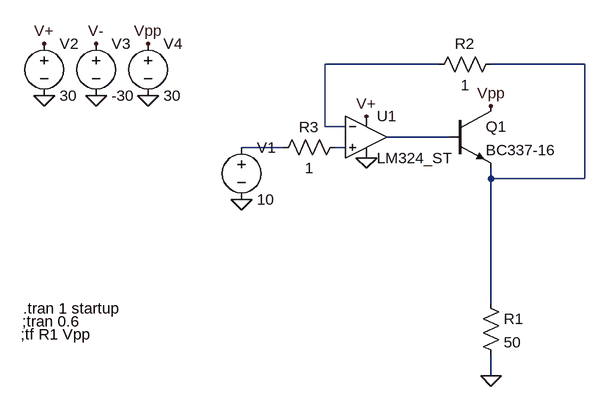
[diagram p0: schematic Draft2.asc]
Draft2.asc, the LTspice schematic file:
Version 4
SHEET 1 880 680
WIRE 288 80 112 80
WIRE 512 80 368 80
WIRE 112 176 112 80
WIRE 144 176 112 176
WIRE 304 192 208 192
WIRE 48 208 -16 208
WIRE 144 208 128 208
WIRE 368 256 368 240
WIRE 512 256 512 80
WIRE 512 256 368 256
WIRE 368 448 368 256
WIRE 368 560 368 528
FLAG -320 48 V+
FLAG 176 160 V+
FLAG -240 48 V-
FLAG -160 48 Vpp
FLAG 368 144 Vpp
FLAG 368 560 0
FLAG -16 288 0
FLAG -160 128 0
FLAG -240 128 0
FLAG -320 128 0
FLAG 176 224 0
SYMBOL EXTRA\\ExtraOpamps\\LM324_ST 176 192 R0
SYMATTR InstName U1
SYMBOL voltage -16 192 R0
WINDOW 123 0 0 Left 0
WINDOW 39 0 0 Left 0
SYMATTR InstName V1
SYMATTR Value 10
SYMBOL npn 304 144 R0
SYMATTR InstName Q1
SYMATTR Value BC337-16
SYMBOL voltage -320 32 R0
WINDOW 123 0 0 Left 0
WINDOW 39 0 0 Left 0
SYMATTR InstName V2
SYMATTR Value 30
SYMBOL voltage -240 32 R0
WINDOW 123 0 0 Left 0
WINDOW 39 0 0 Left 0
SYMATTR InstName V3
SYMATTR Value -30
SYMBOL voltage -160 32 R0
WINDOW 123 0 0 Left 0
WINDOW 39 0 0 Left 0
SYMATTR InstName V4
SYMATTR Value 30
SYMBOL res 352 432 R0
SYMATTR InstName R1
SYMATTR Value 50
SYMBOL res 384 64 R90
WINDOW 0 0 56 VBottom 2
WINDOW 3 32 56 VTop 2
SYMATTR InstName R2
SYMATTR Value 1
SYMBOL res 144 192 R90
WINDOW 0 0 56 VBottom 2
WINDOW 3 32 56 VTop 2
SYMATTR InstName R3
SYMATTR Value 1
TEXT -352 456 Left 2 !.tran 1 startup
TEXT -354 476 Left 2 !;tran 0.6
TEXT -356 496 Left 2 !;tf R1 Vpp

The netlist it stands for:
* Draft2.asc
* U1: LM324_ST (symbol EXTRA\ExtraOpamps\LM324_ST not available, pins judged from their places): In+=N005 In-=N001 V+=V+ V-=0 OUT=N003
V1 N004 0 10
Q1 Vpp N003 N002 0 BC337-16
V2 V+ 0 30
V3 V- 0 -30
V4 Vpp 0 30
R1 N002 0 50
R2 N002 N001 1
R3 N005 N004 1
.model NPN NPN
.model PNP PNP
.lib standard.bjt
.tran 1 startup
;tran 0.6
;tf R1 Vpp
.backanno
.end